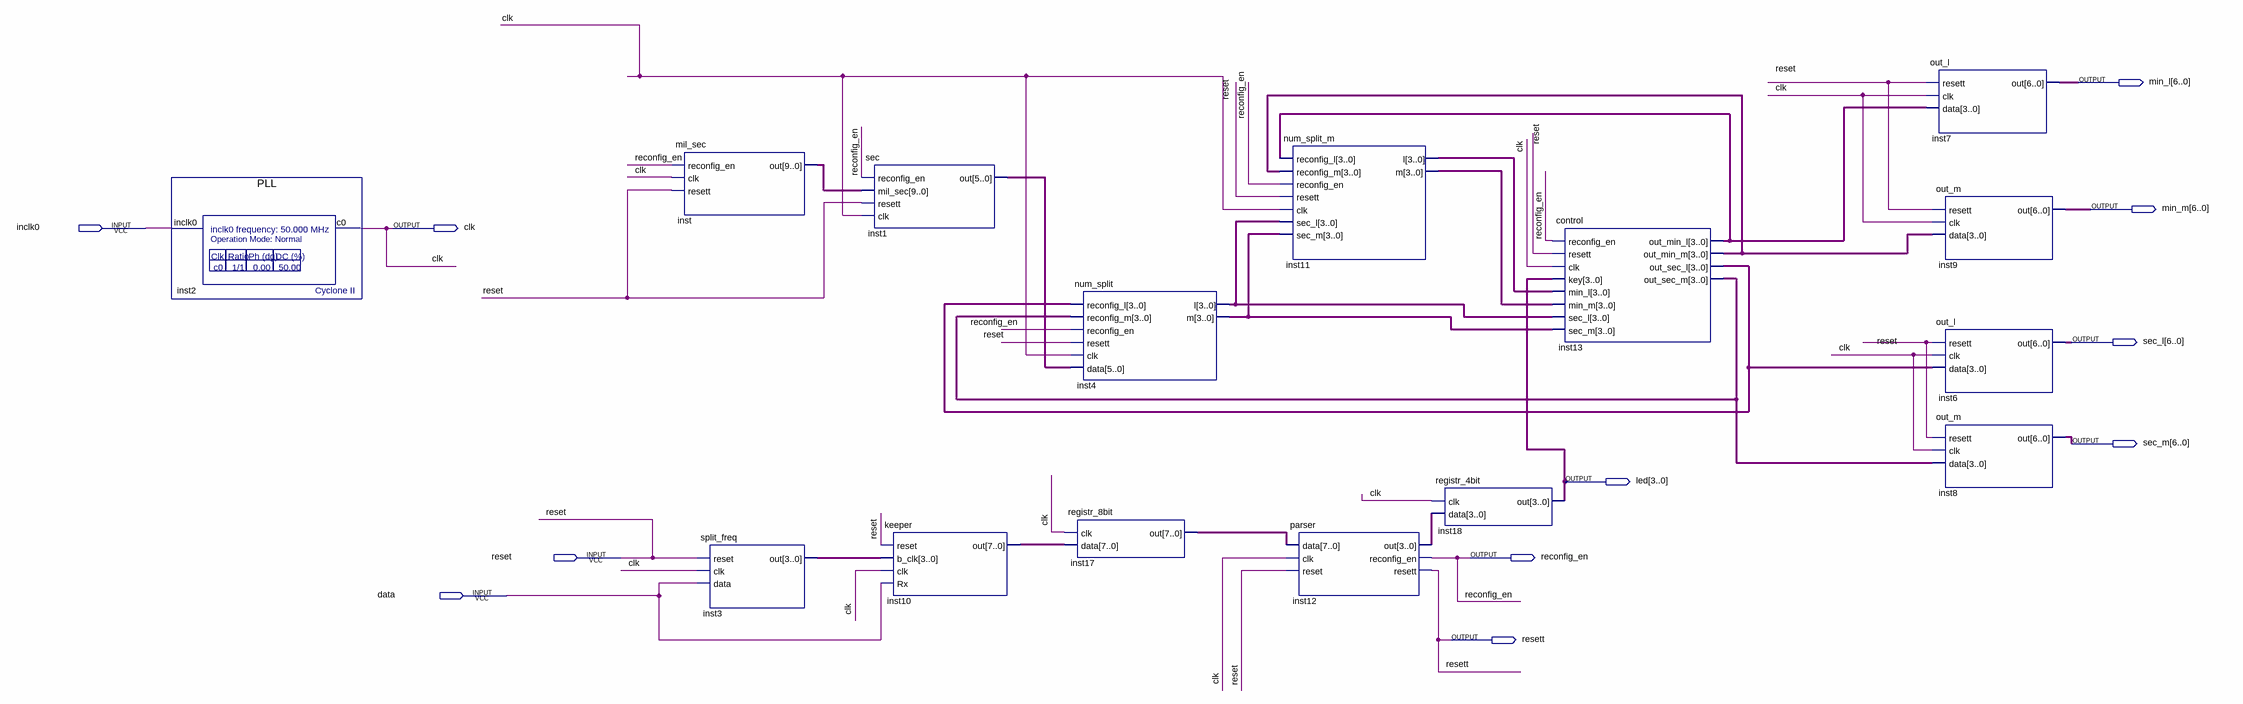
[diagram p0: schematic sheet]
// Quartus schematic Block1.bdf as structural Verilog: 15 symbols, 11 pins
module Block1 (
  input  inclk0,
  input  reset,
  input  data,
  output [6:0] min_l,
  output [6:0] min_m,
  output clk,
  output [6:0] sec_l,
  output [6:0] sec_m,
  output [3:0] led,
  output reconfig_en,
  output resett
);

  wire [3:0] inst3_out, inst4_l, inst4_m, inst11_l, inst11_m, inst12_out, inst13_out_min_l, inst13_out_min_m,
       inst13_out_sec_l, inst13_out_sec_m;
  wire [5:0] inst1_out;
  wire [7:0] inst10_out, inst17_out;
  wire [9:0] inst_out;

  PLL inst2 (.inclk0(inclk0), .c0(clk));
  mil_sec inst (.reconfig_en(reconfig_en), .clk(clk), .resett(reset), .out(inst_out));
  split_freq inst3 (.reset(reset), .clk(clk), .data(data), .out(inst3_out));
  sec inst1 (.reconfig_en(reconfig_en), .mil_sec(inst_out), .resett(reset), .clk(clk), .out(inst1_out));
  keeper inst10 (.reset(reset), .b_clk(inst3_out), .clk(clk), .Rx(data), .out(inst10_out));
  registr_8bit inst17 (.clk(clk), .data(inst10_out), .out(inst17_out));
  num_split inst4 (
    .reconfig_l(inst13_out_sec_l), .reconfig_m(inst13_out_sec_m), .reconfig_en(reconfig_en), .resett(reset),
    .clk(clk), .data(inst1_out), .l(inst4_l), .m(inst4_m));
  num_split_m inst11 (
    .reconfig_l(inst13_out_min_l), .reconfig_m(inst13_out_min_m), .reconfig_en(reconfig_en), .resett(reset),
    .clk(clk), .sec_l(inst4_l), .sec_m(inst4_m), .l(inst11_l), .m(inst11_m));
  parser inst12 (
    .data(inst17_out), .clk(clk), .reset(reset), .out(inst12_out), .reconfig_en(reconfig_en), .resett(resett));
  registr_4bit inst18 (.clk(clk), .data(inst12_out), .out(led));
  control inst13 (
    .reconfig_en(reconfig_en), .resett(reset), .clk(clk), .key(led), .min_l(inst11_l), .min_m(inst11_m),
    .sec_l(inst4_l), .sec_m(inst4_m), .out_min_l(inst13_out_min_l), .out_min_m(inst13_out_min_m),
    .out_sec_l(inst13_out_sec_l), .out_sec_m(inst13_out_sec_m));
  out_l inst7 (.resett(reset), .clk(clk), .data(inst13_out_min_l), .out(min_l));
  out_m inst9 (.resett(reset), .clk(clk), .data(inst13_out_min_m), .out(min_m));
  out_l inst6 (.resett(reset), .clk(clk), .data(inst13_out_sec_l), .out(sec_l));
  out_m inst8 (.resett(reset), .clk(clk), .data(inst13_out_sec_m), .out(sec_m));
endmodule
